# Altium project PCB_Project_FrequencyMeter.PrjPcb
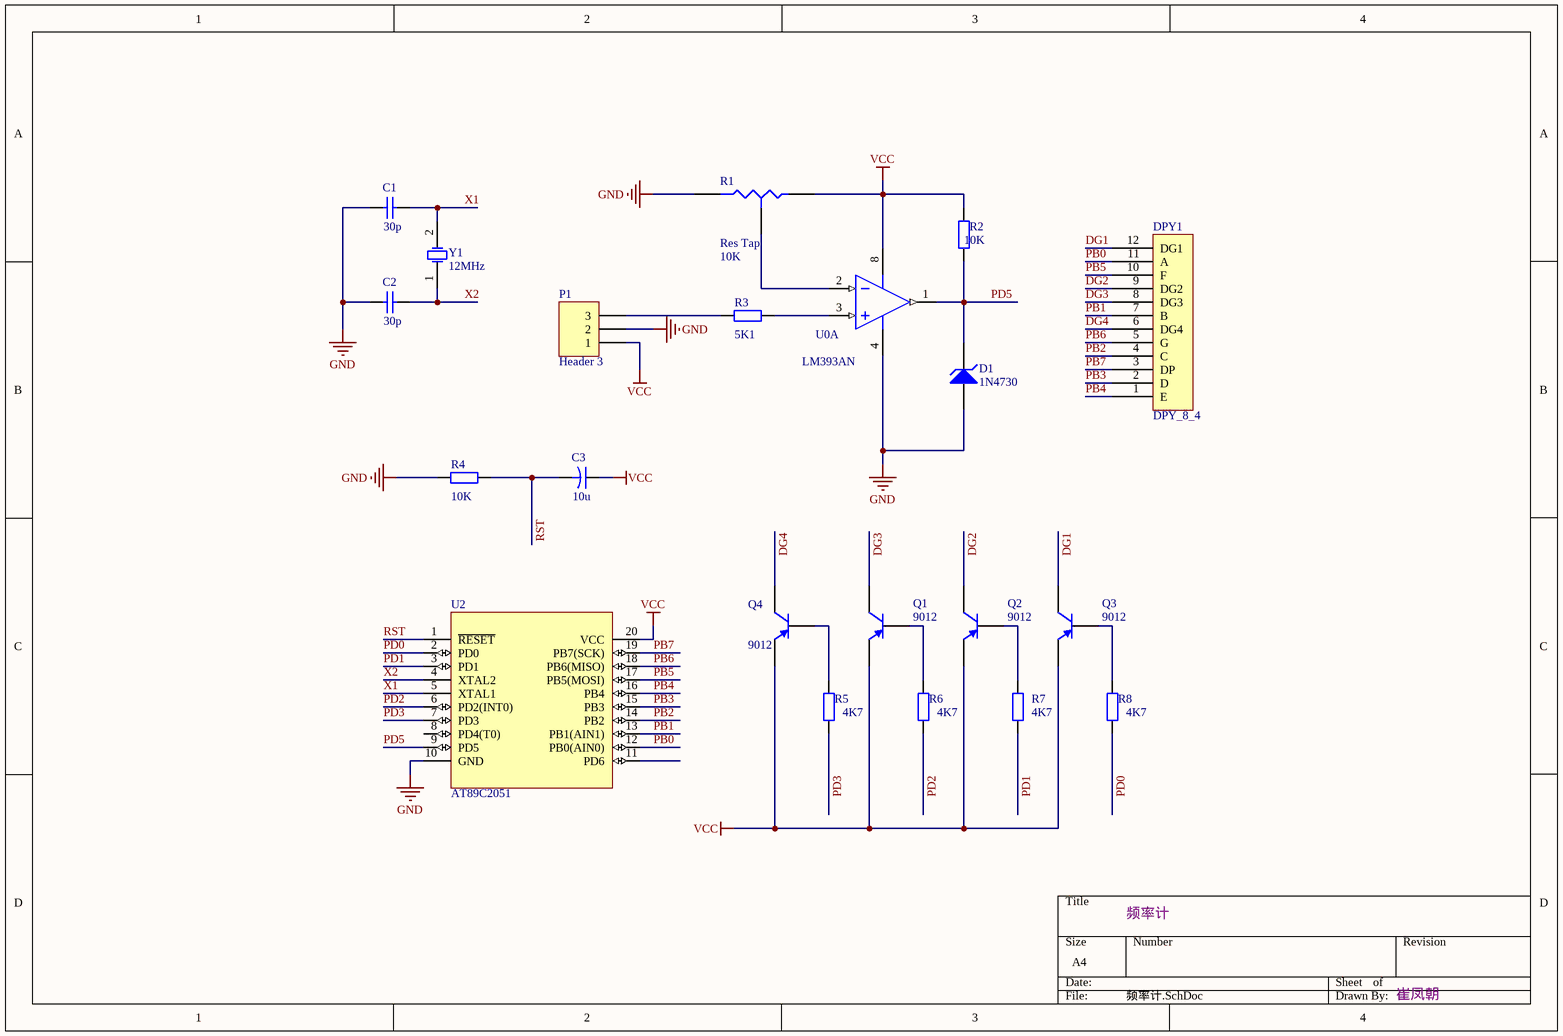
[diagram p0: 频率计.SchDoc]
1 sheet, 21 parts. Net scope: global (net labels, ports and power ports of the same name join across sheets).
Board file: 频率计.PcbDoc

## Sheet 频率计.SchDoc
size A4

### Parts
C1  value 30p  [RAD-0.3]  (hidden comment: Cap)
C2  value 30p  [RAD-0.3]  (hidden comment: Cap)
C3  value 10u  [CAPR5-4X5]  (hidden comment: Cap2)
D1  1N4730  [DIODE-0.7]
DPY1  DPY_8_4  [DPY_8_4]
P1  Header 3  [HDR1X3]
Q1  9012  [TO-237-AA]
Q2  9012  [TO-226-AA]
Q3  9012  [TO-226-AA]
Q4  9012  [TO-226-AA]
R1  Res Tap  value 10K  [VR5]
R2  value 10K  [AXIAL-0.4]  (hidden comment: Res2)
R3  value 5K1  [AXIAL-0.4]  (hidden comment: Res2)
R4  value 10K  [AXIAL-0.4]  (hidden comment: Res2)
R5  value 4K7  [AXIAL-0.4]  (hidden comment: Res2)
R6  value 4K7  [AXIAL-0.4]  (hidden comment: Res2)
R7  value 4K7  [AXIAL-0.4]  (hidden comment: Res2)
R8  value 4K7  [AXIAL-0.4]  (hidden comment: Res2)
U0  LM393AN  [626-05]  (part A of 2)
U2  AT89C2051  [DIP20]
Y1  12MHz  [R38]

### Nets
GND: C1.1 C2.1 D1.1(A) P1.2 R1.2(B) R4.2 U0.4(GND) U2.10(GND)
VCC: C3.1 P1.1 Q1.3(E) Q2.3(E) Q3.3(E) Q4.3(E) R1.1(A) R2.2 U0.8(V+) U2.20(VCC)
DG1: DPY1.12(DG1) Q3.1(C)
DG2: DPY1.9(DG2) Q2.1(C)
DG3: DPY1.8(DG3) Q1.1(C)
DG4: DPY1.6(DG4) Q4.1(C)
PB0: DPY1.11(A) U2.12(PB0(AIN0))
PB1: DPY1.7(B) U2.13(PB1(AIN1))
PB2: DPY1.4(C) U2.14(PB2)
PB3: DPY1.2(D) U2.15(PB3)
PB4: DPY1.1(E) U2.16(PB4)
PB5: DPY1.10(F) U2.17(PB5(MOSI))
PB6: DPY1.5(G) U2.18(PB6(MISO))
PB7: DPY1.3(DP) U2.19(PB7(SCK))
PD0: R8.1 U2.2(PD0)
PD1: R7.1 U2.3(PD1)
PD2: R6.1 U2.6(PD2(INT0))
PD3: R5.1 U2.7(PD3)
PD5: D1.2(K) R2.1 U0.1(OUT) U2.9(PD5)
RST: C3.2 R4.1 U2.1(~{RESET})
X1: C1.2 U2.5(XTAL1) Y1.2(OSC2)
X2: C2.2 U2.4(XTAL2) Y1.1(OSC1)
NetP1_3: P1.3 R3.2
NetQ1_2: Q1.2(B) R6.2
NetQ2_2: Q2.2(B) R7.2
NetQ3_2: Q3.2(B) R8.2
NetQ4_2: Q4.2(B) R5.2
NetR1_3: R1.3(TAP) U0.2(IN-)
NetR3_1: R3.1 U0.3(IN+)

Not connected (* = marked no-connect by the designer): U2 8(PD4(T0)) 11(PD6)

### Notes on the sheet
- Labels drawn without touching a wire or pin: 崔凤朝, 频率计

### Library data of the parts
C1 C2 = Cap: Capacitor; Published: 8-Jun-2000; LatestRevisionDate: 17-Jul-2002; LatestRevisionNote: Re-released for DXP Platform.; PackageReference: RAD-0.3; Publisher: Altium Limited; PackageDescription: Radial Cap, Thru-Hole; 2 Leads; 0.3 in Pin Spacing
C3 = Cap2: Capacitor; Published: 23-Sep-2002; PackageReference: CAPR5-4X5; Publisher: Altium Limited; PackageDescription: Capacitor; 2 Leads
D1 = D Zener: Zener Diode; Published: 8-Jun-2000; LatestRevisionDate: 17-Jul-2002; LatestRevisionNote: Re-released for DXP Platform.; PackageReference: DIODE-0.7; Publisher: Altium Limited; PackageDescription: Diode, Thru-Hole; 2 Leads; 0.7 in Pin Spacing
P1 = Header 3: Header, 3-Pin; LatestRevisionDate: 17-Jul-2002; LatestRevisionNote: Re-released for DXP Platform.; Publisher: Altium Limited
Q1-Q4 = PNP: PNP Bipolar Transistor; Published: 8-Jun-2000; LatestRevisionDate: 29-May-2009; LatestRevisionNote: IPC-7351 Footprint Added.; PackageVersion: Aug-1999; PackageReference: SOT-23B; Publisher: Altium Limited; PackageDescription: 3-Pin SOT-23 Package 0.95 mm Pitch, 2.4 mm Lead Span
R1 = Res Tap: Tapped Resistor; Sim Note: Enter the Resistance value and the set point into parameter fields.; Set Position: 0.5; Published: 24-Mar-1999; LatestRevisionDate: 17-Jul-2002; LatestRevisionNote: Re-released for DXP Platform.; PackageReference: VR3; Publisher: Altium Limited; PackageDescription: Variable Resistor, Thru-Hole; 3 Leads
R2-R8 = Res2: Resistor; Published: 8-Jun-2000; LatestRevisionDate: 17-Jul-2002; LatestRevisionNote: Re-released for DXP Platform.; PackageReference: AXIAL-0.4; Publisher: Altium Limited; PackageDescription: Axial Device, Thru-Hole; 2 Leads; 0.4 in Pin Spacing
U0 = LM393AN: Dual Comparator; Published: 17-Jul-2002; LatestRevisionDate: 06-Jun-2005; LatestRevisionNote: Stylized 3D Model Added.; DatasheetVersion: 1988; PackageReference: 626-05; Publisher: Altium Limited; PackageDescription: DIP; 8 Leads; Row Spacing 7.62 mm; Pitch 2.54 mm; ComponentLink1Description: Manufacturer Link; ComponentLink1URL: http://www.onsemi.com/site/products/taxonomy/0,4438,133,00.html
Y1 = XTAL: Crystal Oscillator; Published: 8-Jun-2000; LatestRevisionDate: 17-Jul-2002; LatestRevisionNote: Re-released for DXP Platform.; PackageReference: R38; Publisher: Altium Limited; PackageDescription: Crystal, Thru-Hole; 2 Leads; Body 3.1 x 8.2 mm (Dia.xH)